# Altium schematic sheet Sheet1.SchDoc
size A3; SheetNumber: 1; SheetTotal: 3
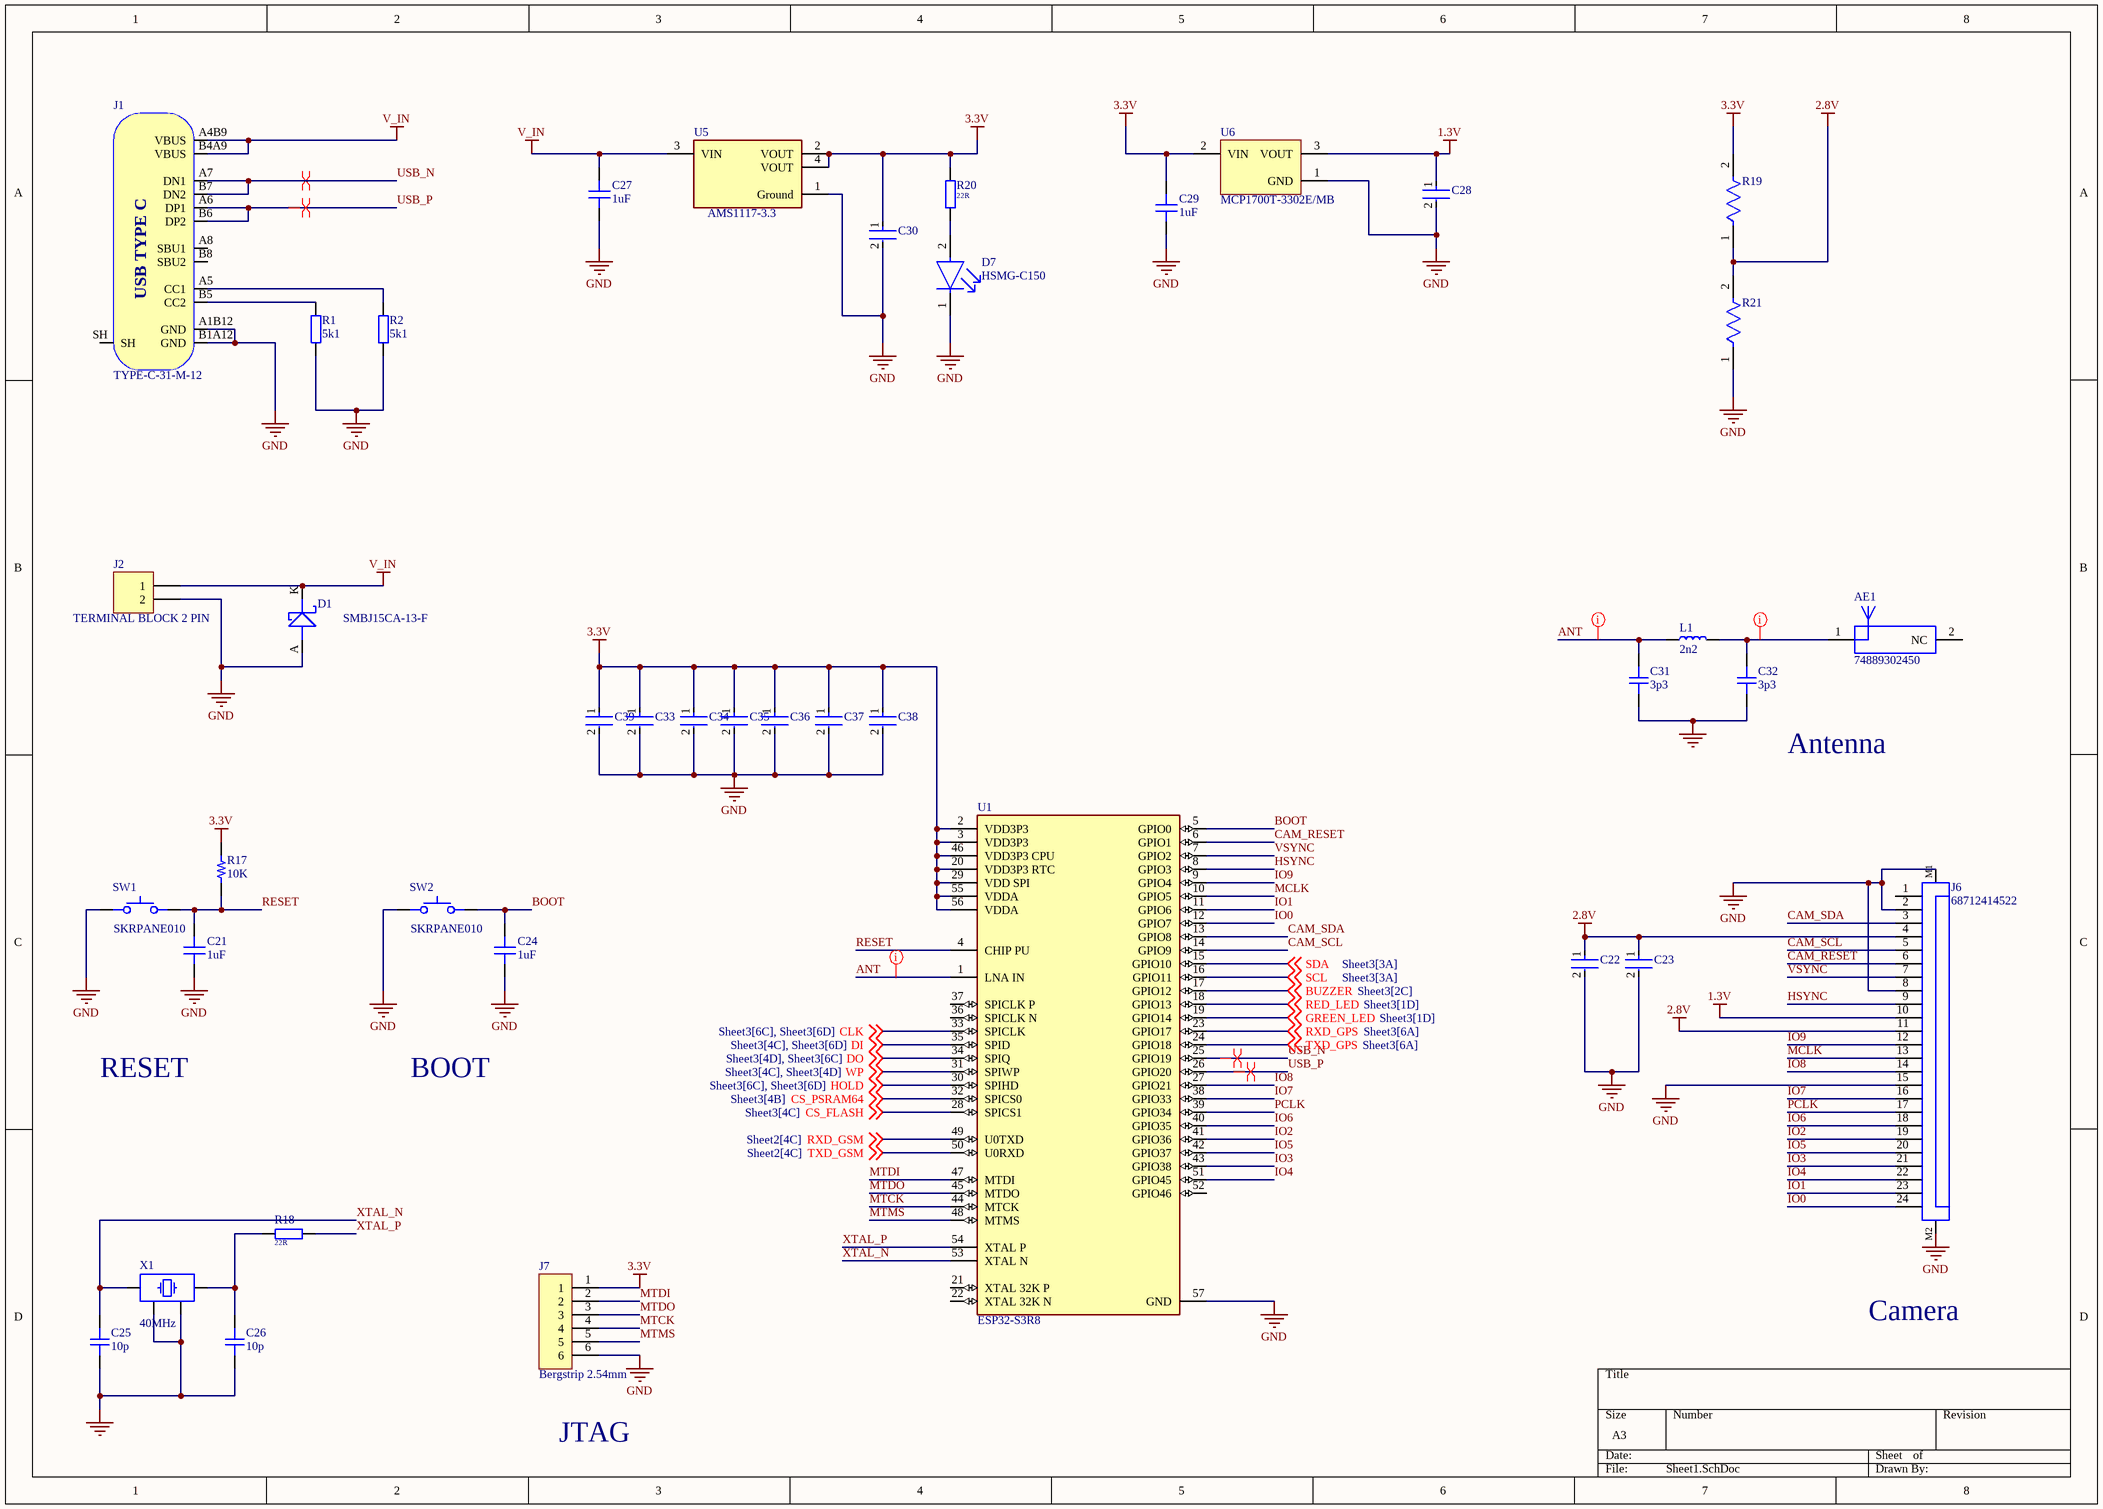
[diagram p0: Sheet1.SchDoc]

## Parts
AE1  74889302450  [74889302450]
C21  1uF  [CAP 0402_1005]
C22  C0402C104K4RACTU  [FP-C0402-BB-MFG]  (value not drawn)
C23  C0402C104K4RACTU  [FP-C0402-BB-MFG]  (value not drawn)
C24  1uF  [CAP 0402_1005]
C25  10p  [CAP_0402]
C26  10p  [CAP_0402]
C27  1uF  [CAP 0402_1005]
C28  C0402C104K4RACTU  [FP-C0402-BB-MFG]  (value not drawn)
C29  1uF  [CAP 0402_1005]
C30  C0402C104K4RACTU  [FP-C0402-BB-MFG]  (value not drawn)
C31  3p3  [CAP_0402]
C32  3p3  [CAP_0402]
C33  C0402C104K4RACTU  [FP-C0402-BB-MFG]  (value not drawn)
C34  C0402C104K4RACTU  [FP-C0402-BB-MFG]  (value not drawn)
C35  C0402C104K4RACTU  [FP-C0402-BB-MFG]  (value not drawn)
C36  C0402C104K4RACTU  [FP-C0402-BB-MFG]  (value not drawn)
C37  C0402C104K4RACTU  [FP-C0402-BB-MFG]  (value not drawn)
C38  C0402C104K4RACTU  [FP-C0402-BB-MFG]  (value not drawn)
C39  C0402C104K4RACTU  [FP-C0402-BB-MFG]  (value not drawn)
D1  SMBJ15CA-13-F  [DIO_SMB_DO-214AA]
D7  HSMG-C150  [FP-HSMG-C150-MFG]
J1  TYPE-C-31-M-12  [TYPE-C-31-M-12]
J2  TERMINAL BLOCK 2 PIN  [CON2_P196_1729128_TH_ST]
J6  68712414522  [68712414522]
J7  Bergstrip 2.54mm  [CON6_100_59D78_TH_ST]
L1  2n2  [IND_0402]
R1  5k1  [RES_0402]
R2  5k1  [RES_0402]
R17  10K  [RES 0402_1005]
R18  22R  [RES_0402]
R19  CRCW06031K00FKEA  [FP-CRCW0603-e3-MFG]  (value not drawn)
R20  22R  [RES_0402]
R21  CRCW06035K60FKEA  [FP-CRCW0603-e3-MFG]  (value not drawn)
SW1  SKRPANE010  [SKRPANE010]
SW2  SKRPANE010  [SKRPANE010]
U1  ESP32-S3R8  [FP-ESP32-S3R8-IPC_A]
U5  AMS1117-3.3  [FP-AMS1117-IPC_C]
U6  MCP1700T-3302E/MB  [SOT-89-MB3_M]
X1  40MHz  [XTAL_2520]

## Nets
1.3V: C28.1 J6.10 U6.3(VOUT)
2.8V: C22.1 C23.1 J6.4 J6.11 R19.1 R21.2
3.3V: C29.2 C30.1 C33.1 C34.1 C35.1 C36.1 C37.1 C38.1 C39.1 J7.1 R17.2 R19.2 R20.1 U1.2(VDD3P3) U1.3(VDD3P3) U1.20(VDD3P3_RTC) U1.29(VDD_SPI) U1.46(VDD3P3_CPU) U1.55(VDDA) U1.56(VDDA) U5.2(VOUT) U5.4(VOUT) U6.2(VIN)
GND: C21.1 C22.2 C23.2 C24.1 C25.1 C26.1 C27.1 C28.2 C29.1 C30.2 C31.1 C32.1 C33.2 C34.2 C35.2 C36.2 C37.2 C38.2 C39.2 D1.A D7.1(C) J1.A1B12(GND) J1.B1A12(GND) J2.2 J6.2 J6.8 J6.15 J6.M1 J6.M2 J7.6 R1.1 R2.1 R21.1 SW1.12 SW2.12 U1.57(GND) U5.1(Ground) U6.1(GND) X1.2 X1.4
V_IN: C27.2 D1.K J1.A4B9(VBUS) J1.B4A9(VBUS) J2.1 U5.3(VIN)
ANT: C31.2 L1.2 U1.1(LNA_IN)
BOOT: C24.2 SW2.34 U1.5(GPIO0)
BUZZER: U1.17(GPIO12) ; off-sheet BUZZER
CAM_RESET: J6.6 U1.6(GPIO1)
CAM_SCL: J6.5 U1.14(GPIO9)
CAM_SDA: J6.3 U1.13(GPIO8)
CLK: U1.33(SPICLK) ; off-sheet CLK
CS_FLASH: U1.28(SPICS1) ; off-sheet CS_FLASH
CS_PSRAM64: U1.32(SPICS0) ; off-sheet CS_PSRAM64
DI: U1.35(SPID) ; off-sheet DI
DO: U1.34(SPIQ) ; off-sheet DO
GREEN_LED: U1.19(GPIO14) ; off-sheet GREEN_LED
HOLD: U1.30(SPIHD) ; off-sheet HOLD
HSYNC: J6.9 U1.8(GPIO3)
IO0: J6.24 U1.12(GPIO7)
IO1: J6.23 U1.11(GPIO6)
IO2: J6.19 U1.41(GPIO36)
IO3: J6.21 U1.43(GPIO38)
IO4: J6.22 U1.51(GPIO45)
IO5: J6.20 U1.42(GPIO37)
IO6: J6.18 U1.40(GPIO35)
IO7: J6.16 U1.38(GPIO33)
IO8: J6.14 U1.27(GPIO21)
IO9: J6.12 U1.9(GPIO4)
MCLK: J6.13 U1.10(GPIO5)
MTCK: J7.4 U1.44(MTCK)
MTDI: J7.2 U1.47(MTDI)
MTDO: J7.3 U1.45(MTDO)
MTMS: J7.5 U1.48(MTMS)
PCLK: J6.17 U1.39(GPIO34)
RED_LED: U1.18(GPIO13) ; off-sheet RED_LED
RESET: C21.2 R17.1 SW1.34 U1.4(CHIP_PU)
RXD_GPS: U1.23(GPIO17) ; off-sheet RXD_GPS
RXD_GSM: U1.49(U0TXD) ; off-sheet RXD_GSM
SCL: U1.16(GPIO11) ; off-sheet SCL
SDA: U1.15(GPIO10) ; off-sheet SDA
TXD_GPS: U1.24(GPIO18) ; off-sheet TXD_GPS
TXD_GSM: U1.50(U0RXD) ; off-sheet TXD_GSM
USB_N: J1.A7(DN1) J1.B7(DN2) U1.25(GPIO19)
USB_P: J1.A6(DP1) J1.B6(DP2) U1.26(GPIO20)
VSYNC: J6.7 U1.7(GPIO2)
WP: U1.31(SPIWP) ; off-sheet WP
XTAL_N: C25.2 U1.53(XTAL_N) X1.1
XTAL_P: R18.1 U1.54(XTAL_P)
NetAE1_1: AE1.1(Feed) C32.2 L1.1
NetC26_2: C26.2 R18.2 X1.3
NetD7_2: D7.2(A) R20.2
NetJ1_A5: J1.A5(CC1) R2.2
NetJ1_B5: J1.B5(CC2) R1.2

Not connected (* = marked no-connect by the designer): AE1 2(NC); J1 A8(SBU1) B8(SBU2) SH; J6 1; U1 21(XTAL_32K_P) 22(XTAL_32K_N) 36(SPICLK_N) 37(SPICLK_P) 52(GPIO46)

## Layout directives
differential pair; differential pair class diff90; rule Differential Pairs Routing [Pref Gap = 5mil    Min Gap  = 5mil    Max Gap  = 5milPref Width = 9.919mil    Min Width  = 9.919mil    Max Width  = 9.919mil]: USB_N, USB_P
net class 50ohm_esp; rule Width Constraint [Pref Impedance = 50.00ohms    Min Impedance = 50.00ohms    Max Impedance = 50.00ohms]: ANT, NetAE1_1

## Notes on the sheet
- (near C32) Antenna
- RESET
- BOOT
- Camera
- JTAG
- (in symbol TYPE-C-31-M-12) USB TYPE C

## Library data of the parts
AE1 = CMP-03913-126098687-1: 74889302450 Chip Antenna, 2.45Ghz, 3.2Mm X 1.6Mm X 1.2Mm Rohs Compliant: Yes; Current Rating: 2A; Impedance: 50Ω; RoHS: Compliant; Length: 3.2mm; Width: 1.6mm; NexarPartId: 126098687; Max Operating Temperature: 85°C; Min Operating Temperature: -40°C; Height: 1.2mm
C21 C24 C27 C29 = Cap 0402: SMT Capacitor; VALUE: 100nF
C22 C23 C28 C30 C33-C39 = CMP-2008-02108-2: CAP CER 0.1UF 16V X7R 0402; Manufacturer: Kemet; Value: 0.10 μF; Tolerance: 0.1; Material: Ceramic; Temperature Coefficient: 15%; Voltage Rating: 16 V; Package: C0402-BB; Automotive: No; Ipc Land Pattern Name: CAPC10050X50; Device Class L3: Ceramic Capacitors; Capacitance: 0.10 μF; Octopart: https://octopart.com/c0402c104k4ractu-kemet-94158; Temperature Characteristic: X7R; Mouser Description: Cap Ceramic 0.1uF 16V X7R 10% SMD 0402 125?C Paper T/R - Tape and Reel (Alt: C0402C104K4RAC TU); ComponentLink2Description: Datasheet; Temperature Range Low: -55°C; RoHS: TRUE; Device Class L1: Passive Components; Manufacturer Part Number: C0402C104K4RACTU; Temperature Range High: +125°C; Device Class L2: Capacitors; ComponentLink2URL: https://content.kemet.com/datasheets/KEM_C1002_X7R_SMD.pdf; Category: Cap; Height: 0.55mm; Temperature: -55°C to +125°C; Lead Free: Yes; Digikey Description: CAP CER 0.1UF 16V X7R 0402
C25 C26 = CAP_0402_50V: Capacitor SMD 0402 50V; Manufacturer: Samsung; Manufacturer Part Number: CL05C100JB5NNNC; LCSC: C32949
C31 C32 = CAP_0402_50V: Capacitor SMD 0402 50V; Manufacturer: FH; Manufacturer Part Number: 0402CG3R3C500NT; LCSC: C1565
D1 = DIO-T_15V-24V-24.6A-DO214AA: 24.4V Clamp 24.6A Ipp Tvs Diode Surface Mount DO-214AA (SMBJ); Manufacturer: Nexperia; Alternate Part Number-1: NA; Manufacturer Part Number: SMBJ15CA-13-F; Case/Package: DO214AA; Supplier-1: SIRICOM; Supplier Part Number-1: SMBJ15CA-13-F
D7 = CMP-2000-05061-2: LED GREEN DIFFUSED 1206 SMD; Manufacturer: Broadcom; Led Orientation: Top View; Max Junction Temp: +95°C; Peak Emmision Wavelength: 570nm; Viewing Angle: 170°; Wavelength: 572nm; Reverse Voltage: 5V; Luminous Intensity: 15mcd; Forward Voltage: 2.2V; Power Dissipation: 65mW; Forward Current: 20mA; ComponentLink2Description: Datasheet; Lead Free: Yes; Temperature Range Low: -40°C; Package: HSMG-C150; Digikey Description: LED GREEN DIFFUSED 1206 SMD; Mouser Description: LED Uni-Color Green 570nm 2-Pin Chip LED T/R; Manufacturer Part Number: HSMG-C150; Temperature Range High: +85°C; Device Class L1: Optoelectronics; Colour: Green; Category: Diode; Device Class L3: unset; RoHS: TRUE; Height: 1.2mm; ComponentLink2URL: https://docs.broadcom.com/docs/AV02-0551EN; Device Class L2: LEDs; Automotive: No; Ipc Land Pattern Name: DIOCP320160X55; Octopart: https://octopart.com/hsmg-c150-broadcom-71131304; Temperature: -40°C to +85°C
J1 = TYPE-C-31-M-12: USB Type C Connector Horizontal SMT; Manufacturer: Koren Hroparts; Manufacturer Part Number: TYPE-C-31-M-12; LCSC: C165948
J2 = CON-TB_2X1-196-ST-TH: 2 Pins, 1 Row 5mm Pitch, straight Connector, male; Manufacturer: Phoenix Contact; Manufacturer Part Number: MKDSN1,5/2; Alternate Part Number-1: NA; Case/Package: TH-CON; Supplier-1: SP ROAD; Supplier Part Number-1: MKDSN1,5/2
J6 = CMP-1502-01537-2: NexarPartId: 22802324; Pitch: 500µm; Contact Location: Top; Current Rating: 500mA; Actuator Material: Liquid Crystal Polymer, Polymer; Number of Contacts: 24; Voltage Rating: 50V; Gender: Receptacle; Contact Resistance: 20mΩ; Insulation Resistance: 100MΩ; REACH SVHC: Unknown; Packaging: Tape and Reel; Width: 2.1mm; Contact Plating: Tin; Lead Pitch: 500µm; Min Operating Temperature: -25°C; RoHS: Compliant; Housing Material: Liquid Crystal Polymer; Number of Pins: 24; Flammability Rating: UL94 V-0; Max Operating Temperature: 85°C; Number of Positions: 24; Number of Rows: 1; Operating Supply Voltage: 50V; Contact Material: Bronze, Tin; Mount: Surface Mount; Orientation: Horizontal; Length: 18.4mm; Termination: SMD/SMT
J7 = CON-BS-SKT_6X1-100-ST-TH: 6 Pins, 1 Row 2.54mm Pitch, Straight bergstrip, Female; Manufacturer: Molex; Alternate Part Number-1: NA; Manufacturer Part Number: 22-10-2061; Case/Package: TH-CON; Supplier-1: SP ROAD; Supplier Part Number-1: NA
L1 = IND_0402: Inductor SMD 0402; Manufacturer: Murata; Manufacturer Part Number: LQW15AN2N2G80D; LCSC: C412264
R1 R2 = RES_0402: Resistor SMD 0402; Manufacturer: YAGEO; Manufacturer Part Number: RC0402JR-075K1L; LCSC: C105873
R17 = Res 0402: SMT Resistor; VALUE: 1K
R18 R20 = RES_0402: Resistor SMD 0402; Manufacturer: UNI-ROYAL; Manufacturer Part Number: 0402WGF220JTCE; LCSC: C25092
R19 = CMP-1666-00003-5: RES Thick Film, 1kΩ, 1%, 0.1W, 100ppm/°C, 0603; Max Power Dissipation: 100mW; Voltage Rating: 75V; Resistance: 1kR; Max Operating Temperature: 155°C; Number of Pins: 2; Case Code (Imperial): 0603; Width: 0.033inch; Power Rating: 100mW; Number of Terminations: 2; Package Quantity: 10; Weight: 7.1E-05oz; Tolerance: 1%; Temperature Coefficient: 100ppm/°C; Military Standard: Not; Mount: Surface Mount; Voltage Rating (DC): 75V; Depth: 0.85mm; Composition: Thick Film; Radiation Hardening: No; Termination: SMD/SMT; Length: 1.55mm; Case Code (Metric): 1608; Contact Plating: Tin; Min Operating Temperature: -55°C; Packaging: Tape and Reel; Height: 0.45mm; Lead Free: Lead Free; Case/Package: 0603; Features: Automotive AEC-Q200
R21 = CMP-2000-03487-2: RES Thick Film, 5.6kΩ, 1%, 0.1W, 100ppm/°C, 0603; Voltage Rating: 75V; Power Rating: 100mW; Resistance: 5.6kR; Packaging: Tape and Reel; Case/Package: 0603; Depth: 0.85mm; Package Quantity: 5000; Working Voltage: 75V; Case Code (Metric): 1608; Height: 0.45mm; Voltage Rating (DC): 75V; Tolerance: 1%; Number of Pins: 2; Weight: 7.1E-05oz; Composition: Thick Film; Width: 0.85mm; Temperature Coefficient: 100ppm/°C; Min Operating Temperature: -55°C; Radiation Hardening: No; Contact Plating: Tin; Case Code (Imperial): 0603; Max Operating Temperature: 155°C; Mount: Surface Mount; Length: 1.55mm; Lead Free: Lead Free; Military Standard: Not; Number of Terminations: 2; Termination: SMD/SMT
SW1 SW2 = SKRPANE010: Tactile Switch SMD SPST; Manufacturer: Alps Alpine; Manufacturer Part Number: SKRPANE010; LCSC: C470426
U1 = CMP-10700-118292493-1: ESP32-S3R8 RF System on a Chip - SoC SMD IC, Dual-Core MCU, Wi-Fi 2.4G BLE 5.0 Combo; NexarPartId: 118292493
U5 = CMP-209535-000001-1: LDO Voltage Regulators 1A, 3.3V; Manufacturer: Advanced Monolithic Systems; Dropout Voltage: 1.1V; Output Type: Fixed; Nominal Supply Current: 5mA; Max Power Dissipation: 1.2W; Max Supply Voltage: 15V; Number Of Outputs: 1; Standoff Height: 0.64mm; Max Junction Temp: +125°C; Height: 1.8mm; Package: AMS1117; Device Class L2: Power Management ICs; ComponentLink2Description: Datasheet; ComponentLink2URL: http://www.advanced-monolithic.com/pdf/ds1117.pdf; Category: IC; RoHS: TRUE; Automotive: No; Device Class L1: Integrated Circuits (ICs); Output Current: 1A; Device Class L3: Voltage Regulators - Linear; Temperature: -40°C to +125°C; Output Voltage: 3.3V; Manufacturer Part Number: AMS1117-3.3; Temperature Range Low: -40°C; Octopart: https://octopart.com/ams1117-3.3-advanced+monolithic+systems-25899300; Lead Free: Yes; Ipc Land Pattern Name: SOT229P700X180-4; Temperature Range High: +125°C
U6 = CMP-0136-00812-1: Low Quiescent Current LDO, 3-Pin SOT-89, Extended Temperature, Tape and Reel; PackageDescription: 3-Lead Plastic Small Outline Transistor Header (MB) [SOT-89]; PackageReference: SOT-89-MB3; DatasheetVersion: revB, Feb-2007; Code_IPC: SOT89; PackageVersion: revBB, Aug-2009
X1 = XTAL_2520: Crystal SMD 2520; Manufacturer: Seiko Epson; Manufacturer Number: Q24FA20H0020900; Frequency: 40MHz; LCSC: C255973